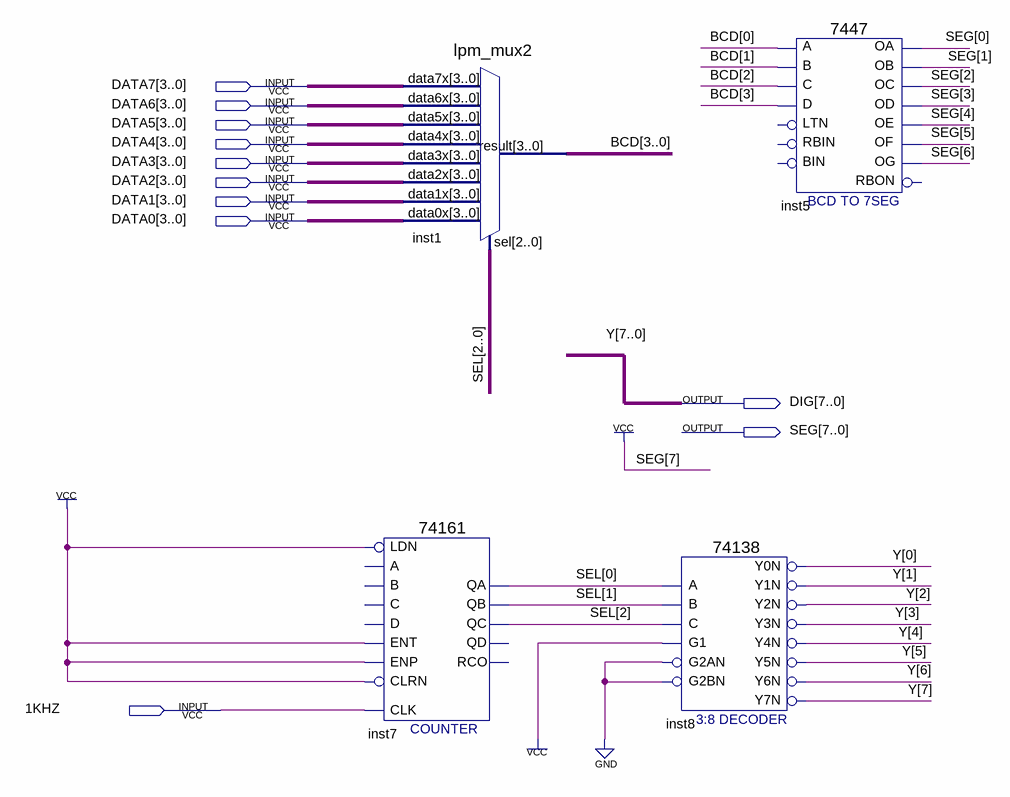
[diagram p0: schematic sheet]
// Quartus schematic DASEPLAY_BCD.bdf as structural Verilog: 4 symbols, 11 pins
module DASEPLAY_BCD (
  input  [3:0] DATA7,
  input  [3:0] DATA6,
  input  [3:0] DATA5,
  input  [3:0] DATA4,
  input  [3:0] DATA3,
  input  [3:0] DATA2,
  input  [3:0] DATA1,
  input  [3:0] DATA0,
  input  \1KHZ ,
  output [7:0] DIG,
  output [7:0] SEG
);

  wire [2:0] SEL;
  wire [3:0] BCD;

  lpm_mux2 inst1 (
    .data7x(DATA7), .data6x(DATA6), .data5x(DATA5), .data4x(DATA4), .data3x(DATA3), .data2x(DATA2),
    .data1x(DATA1), .data0x(DATA0), .sel(SEL), .result(BCD));
  \74161  inst7 (
    .CLRN(1'b1), .CLK(\1KHZ ), .ENP(1'b1), .LDN(1'b1), .ENT(1'b1), .QC(SEL[2]), .QB(SEL[1]), .QA(SEL[0]));  // open: A, D, B, C, QD, RCO
  \74138  inst8 (
    .A(SEL[0]), .B(SEL[1]), .G1(1'b1), .C(SEL[2]), .G2AN(1'b0), .G2BN(1'b0), .Y0N(DIG[0]), .Y1N(DIG[1]),
    .Y2N(DIG[2]), .Y3N(DIG[3]), .Y4N(DIG[4]), .Y5N(DIG[5]), .Y6N(DIG[6]), .Y7N(DIG[7]));
  \7447  inst5 (
    .B(BCD[1]), .C(BCD[2]), .D(BCD[3]), .A(BCD[0]), .OB(SEG[1]), .OC(SEG[2]), .OE(SEG[4]), .OD(SEG[3]),
    .OF(SEG[5]), .OG(SEG[6]), .OA(SEG[0]));  // open: LTN, RBIN, BIN, RBON

  assign SEG[7] = 1'b1;

  // Other names for the same wires on the sheet: Y[7:0] = DIG
endmodule
